# Altium project Mixed Signal Board.PrjPcb
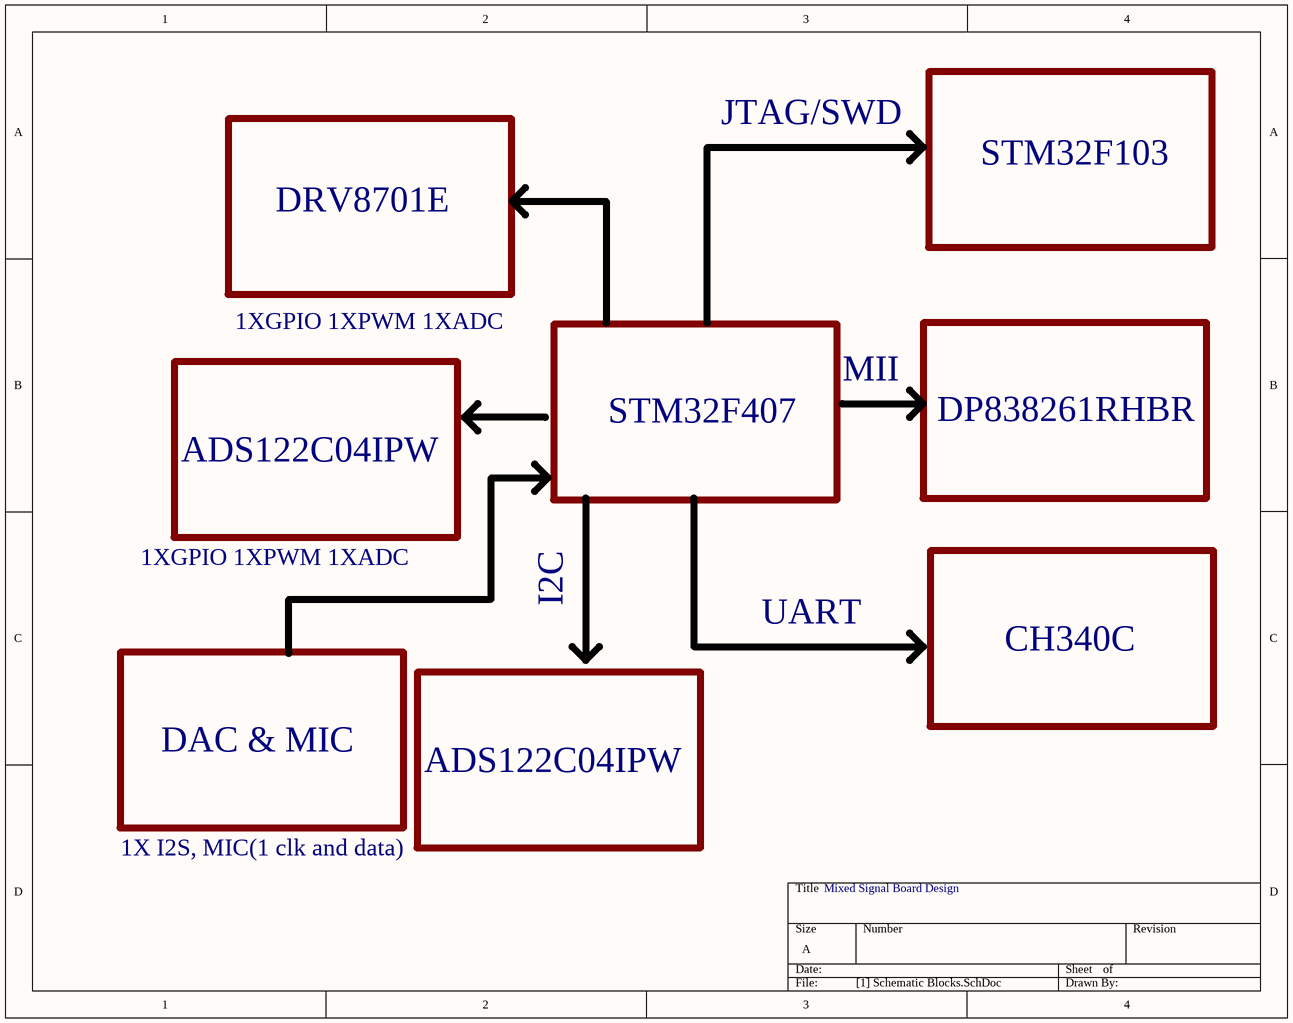
[diagram p0: [1] Schematic Blocks.SchDoc]
8 sheets, 105 parts. Net scope: flat (ports and power ports of the same name join across sheets).
Sheets:
  [1] Schematic Blocks.SchDoc
  [2] Power Budget.SchDoc
  [3] STM32F103 Debugger.SchDoc
  [4] ETHERNET PHY.SchDoc
  [5] Motor Driver Schematic.SchDoc
  [6] CH340C.SchDoc
  [7] Analog to Digital Converter.SchDoc
  [8] DAC and MIC.SchDoc

## Sheet [1] Schematic Blocks.SchDoc
size A; SheetNumber: 1; SheetTotal: 1

### Notes on the sheet
- JTAG/SWD
- DRV8701E
- STM32F103
- 1XGPIO 1XPWM 1XADC
- STM32F407
- MII
- DP838261RHBR
- ADS122C04IPW
- I2C
- UART
- CH340C
- DAC & MIC
- 1X I2S, MIC(1 clk and data)
- Mixed Signal Board Design

## Sheet [2] Power Budget.SchDoc
size A; SheetNumber: 2; SheetTotal: 4
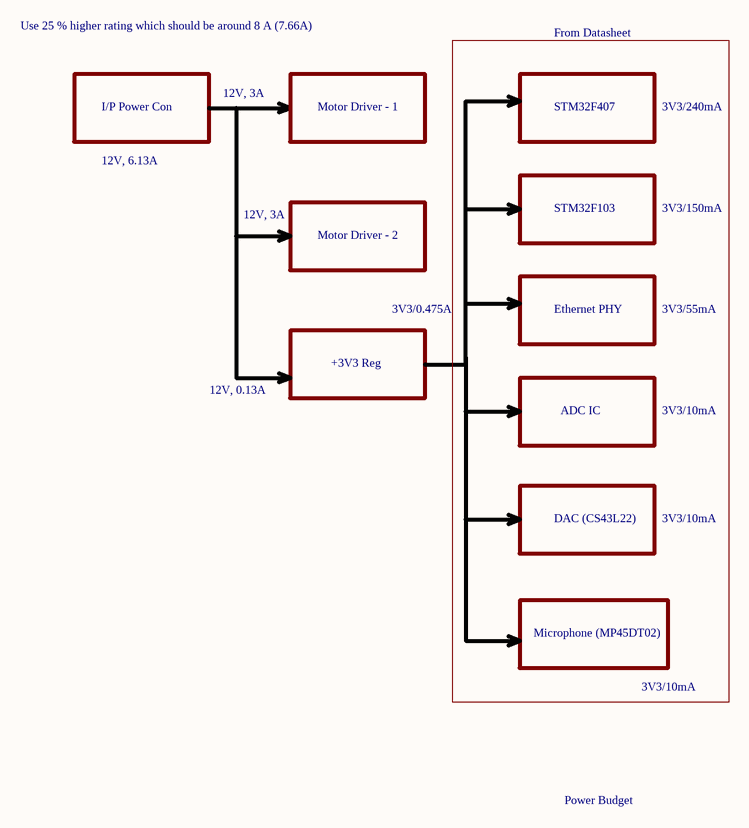
[diagram p1: [2] Power Budget.SchDoc]

### Notes on the sheet
- Use 25 % higher rating which should be around 8 A (7.66A)
- From Datasheet
- I/P Power Con
- 12V, 3A
- Motor Driver - 1
- STM32F407
- 3V3/240mA
- 12V, 6.13A
- STM32F103
- 3V3/150mA
- Motor Driver - 2
- 3V3/0.475A
- Ethernet PHY
- 3V3/55mA
- 12V, 0.13A
- +3V3 Reg
- ADC IC
- 3V3/10mA
- DAC (CS43L22)
- Microphone (MP45DT02)
- Power Budget

## Sheet [3] STM32F103 Debugger.SchDoc
size A; SheetNumber: 3; SheetTotal: 4
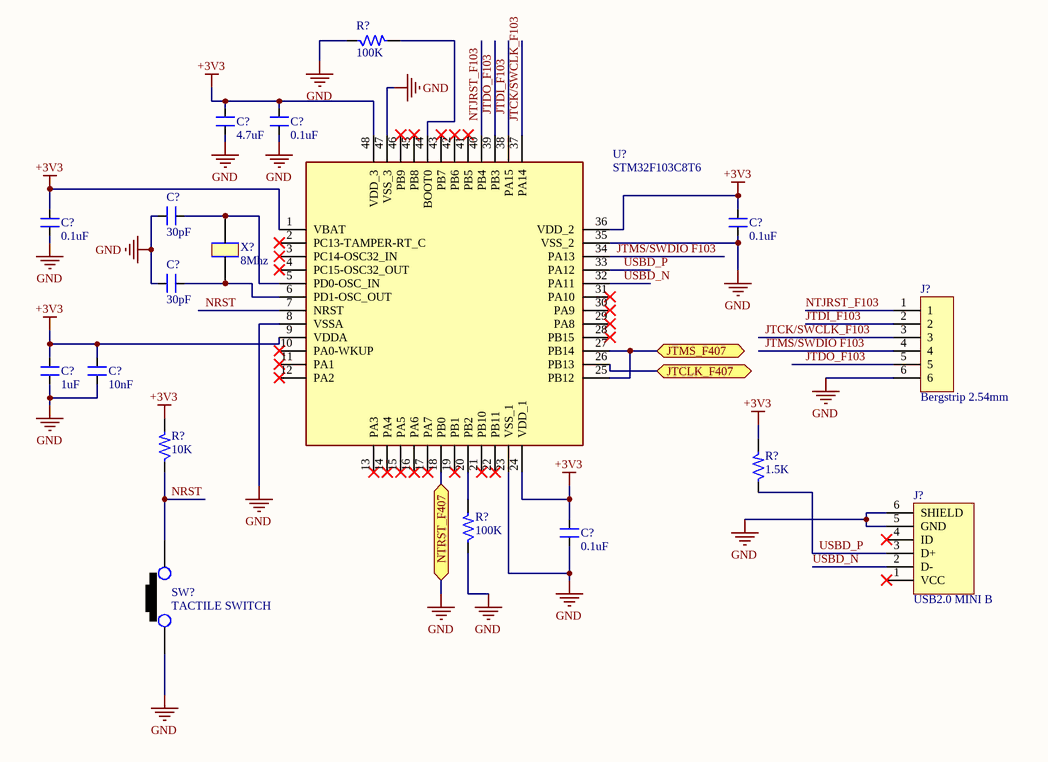
[diagram p2: [3] STM32F103 Debugger.SchDoc]

### Parts
(Parts that share a designator on the sheet are numbered #1, #2 ... from top to bottom, then left to right.)
C?#1  4.7uF  [CAP_0805]
C?#2  0.1uF  [CAP_0805]
C?#3  30pF  [CAP_0805]
C?#4  0.1uF  [CAP_0805]
C?#5  0.1uF  [CAP_0805]
C?#6  30pF  [CAP_0805]
C?#7  1uF  [CAP_0805]
C?#8  10nF  [CAP_0805]
C?#9  0.1uF  [CAP_0805]
J?#1  Bergstrip 2.54mm  [CON6_100_59D78_TH_ST]
J?#2  USB2.0 MINI B  [CON_690-005-299-043]
R?#1  100K  [RES_0603]
R?#2  10K  [RES_0805]
R?#3  1.5K  [RES_0805]
R?#4  100K  [RES_0603]
SW?#1  TACTILE SWITCH  [SW_342_SMD]
U?#1  STM32F103C8T6  [LQFP-48_19.6_393_58X11_SMD]
X?  8Mhz  [XTAL_314_240X47_SMD]

### Ports
JTCLK_F407 (bidir), JTMS_F407 (bidir), NTRST_F407 (bidir)

### Nets
+3V3: C?#1.2 C?#2.2 C?#4.2 C?#5.2 C?#7.2 C?#8.2 C?#9.2 R?#2.2 R?#3.2 U?#1.1(VBAT) U?#1.9(VDDA) U?#1.24(VDD_1) U?#1.36(VDD_2) U?#1.48(VDD_3)
GND: C?#1.1 C?#2.1 C?#3.1 C?#4.1 C?#5.1 C?#6.1 C?#7.1 C?#8.1 C?#9.1 J?#1.6 J?#2.5(GND) J?#2.6(SHIELD) R?#1.1 R?#4.1 SW?#1.1 U?#1.8(VSSA) U?#1.18(PB0) U?#1.23(VSS_1) U?#1.35(VSS_2) U?#1.47(VSS_3) ; port NTRST_F407  [project net SN]
JTCK/SWCLK_F103: J?#1.3 U?#1.37(PA14)
JTCLK_F407: U?#1.26(PB13) ; port JTCLK_F407
JTDI_F103: J?#1.2 U?#1.38(PA15)
JTDO_F103: J?#1.5 U?#1.39(PB3)
JTMS/SWDIO F103: J?#1.4 U?#1.34(PA13)
JTMS_F407: U?#1.25(PB12) U?#1.27(PB14) ; port JTMS_F407
NRST: R?#2.1 SW?#1.2 U?#1.7(NRST)
NTJRST_F103: J?#1.1 U?#1.40(PB4)
USBD_N: J?#2.2(D-) U?#1.32(PA11)
USBD_P: J?#2.3(D+) R?#3.1 U?#1.33(PA12)
NetC?#3_2: C?#3.2 U?#1.5(PD0-OSC_IN) X?.2
NetC?#6_2: C?#6.2 U?#1.6(PD1-OSC_OUT) X?.1
NetR?#1_2: R?#1.2 U?#1.44(BOOT0)
NetR?#4_2: R?#4.2 U?#1.20(PB2)

Not connected (* = marked no-connect by the designer): J?#2 1(VCC)* 4(ID)*; U?#1 2(PC13-TAMPER-RT_C)* 3(PC14-OSC32_IN)* 4(PC15-OSC32_OUT)* 10(PA0-WKUP)* 11(PA1)* 12(PA2)* 13(PA3)* 14(PA4)* 15(PA5)* 16(PA6)* 17(PA7)* 19(PB1)* 21(PB10)* 22(PB11)* 28(PB15)* 29(PA8)* 30(PA9)* 31(PA10)* 41(PB5)* 42(PB6)* 43(PB7)* 45(PB8)* 46(PB9)*

### Library data of the parts
C?#1 = CAP_4.7uF-50V-10%-0805: 4.7µF ±10% 50V Ceramic Capacitor X5R 0805 (2012 Metric); Manufacturer: Yageo; Manufacturer Part Number: GRM21BR61H475KE51L; Alternate Part Number-1: NA; Case/Package: 0805; Supplier-1: SIRICOM; Supplier Part Number-1: CL21A475KBQNNNE
C?#2 C?#4 C?#5 C?#9 = CAP_0.1uF-50V-10%-0805: 0.1µF ±10% 50V Ceramic Capacitor X7R 0805 (2012 Metric); Manufacturer: Samsung; Manufacturer Part Number: CL21B104KBCNNNC; Alternate Part Number-1: NA; Case/Package: 0805; Supplier-1: SIRICOM; Supplier Part Number-1: 0805B104K500CT
C?#3 C?#6 = CAP_30pF-50V-10%-0805: ±10% 50V Ceramic Capacitor C0G, NP0 0805 (2012 Metric); Manufacturer Part Number: C0805C300K5GAC7800; Manufacturer: KEMET; Alternate Part Number: NA; Case/Package: 0805; Supplier-1: Digikey; Supplier Part Number-1: 399-17443-1-ND - Cut Tape (CT)
C?#7 = CAP_1uF-50V-5%-0805: 1µF ±5% 50V Ceramic Capacitor X7R 0805 (2012 Metric); Manufacturer: Samsung; Manufacturer Part Number: CC0805JKX7R9BB105; Alternate Part Number-1: 0805F105M500NT; Case/Package: 0805; Supplier-1: SIRICOM; Supplier Part Number-1: CL21B105KBFNNNE
C?#8 = CAP_10nF-50V-10%-0805: 10000pF ±10% 50V Ceramic Capacitor X7R 0805 (2012 Metric); Manufacturer: Samsung; Manufacturer Part Number: C0805C103K5RECAUTO; Alternate Part Number-1: GRM2195C1H103JA01D; Case/Package: 0805; Supplier-1: SIRICOM; Supplier Part Number-1: 0805B103K500CT
J?#1 = CON-BS-SKT_6X1-100-ST-TH: 6 Pins, 1 Row 2.54mm Pitch, Straight bergstrip, Female; Manufacturer: Molex; Alternate Part Number-1: NA; Manufacturer Part Number: 22-10-2061; Case/Package: TH-CON; Supplier-1: SP ROAD; Supplier Part Number-1: NA
J?#2 = CON_USB2.0-MINIB-SMD: USB - mini B USB 2.0 Receptacle Connector 5 Position Surface Mount, Right Angle; Manufacturer: EDAC; Manufacturer Part Number: 690-005-299-043; Alternate Part Number-1: NA; Case/Package: USB-MINI-B; Supplier-1: LCSC; Supplier Part Number-1: C105424
R?#1 R?#4 = RES_100K-0.1W-1%-0603: 100 kOhms ±1% 0.1W, 1/10W Chip Resistor 0603 (1608 Metric) Automotive AEC-Q200 Thick Film; Manufacturer: Stackpole Electronics; Manufacturer Part Number: RMCF0603FT100K; Alternate Part Number-1: NA; Case/Package: 0603; Supplier-1: Arrow; Supplier Part Number-1: RMCF0603FT100K
R?#2 = RES_10K-0.125W-1%-0805: 10 kOhms ±1% 0.125W, 1/8W Chip Resistor 0805 (2012 Metric) Automotive AEC-Q200 Thick Film; Manufacturer: CTS; Manufacturer Part Number: WR08X1002FTL; Case/Package: 0805; Supplier-1: SIRICOM; Supplier Part Number-1: WR08X1002FTL; Alternate Part Number-1: WR08X1002FTL
R?#3 = RES_1.5K-0.125W-1%-0805: 1.5 kOhms ±1% 0.125W, 1/8W Chip Resistor 0805 (2012 Metric) Thick Film; Manufacturer: TE Connectivity Passive Product; Manufacturer Part Number: CRG0805F1K5; Alternate Part Number-1: NA; Case/Package: 0805; Supplier-1: SIRICOM; Supplier Part Number-1: NA
SW?#1 = SW1_RS-282G05A3-SMRT-SMD: Tactile Switch SPST-NO Top Actuated Surface Mount; Manufacturer: ITT C&K; Alternate Part Number-1: NA; Manufacturer Part Number: RS-282G05A3-SMRT; Case/Package: SMD; Supplier-1: SP ROAD; Supplier Part Number-1: RS-282G05A3-SMRT
U?#1 = IC_STM32F103C8T6: ARM® Cortex®-M3 STM32F1 Microcontroller IC 32-Bit 72MHz 64KB (64K x 8) FLASH 48-LQFP (7x7); Manufacturer: STMicroelectronics; Alternate Part Number-1: NA; Manufacturer Part Number: STM32F103C8T6; Case/Package: LQFP48; Supplier-1: LCSC; Supplier Part Number-1: STM32F103C8T6
X? = XTAL_8MHZ-ECS-80-32-5PX-SMD: 8MHz ±30ppm Crystal 32pF 60 Ohms HC-49/US; Manufacturer: Fox Electronics; Manufacturer Part Number: ECS-80-32-5PX-TR; Alternate Part Number-1: NA; Case/Package: SMD/SMT; Supplier-1: SP ROAD; Supplier Part Number-1: ECS-80-32-5PX-TR

## Sheet [4] ETHERNET PHY.SchDoc
size A; SheetNumber: 4; SheetTotal: 5
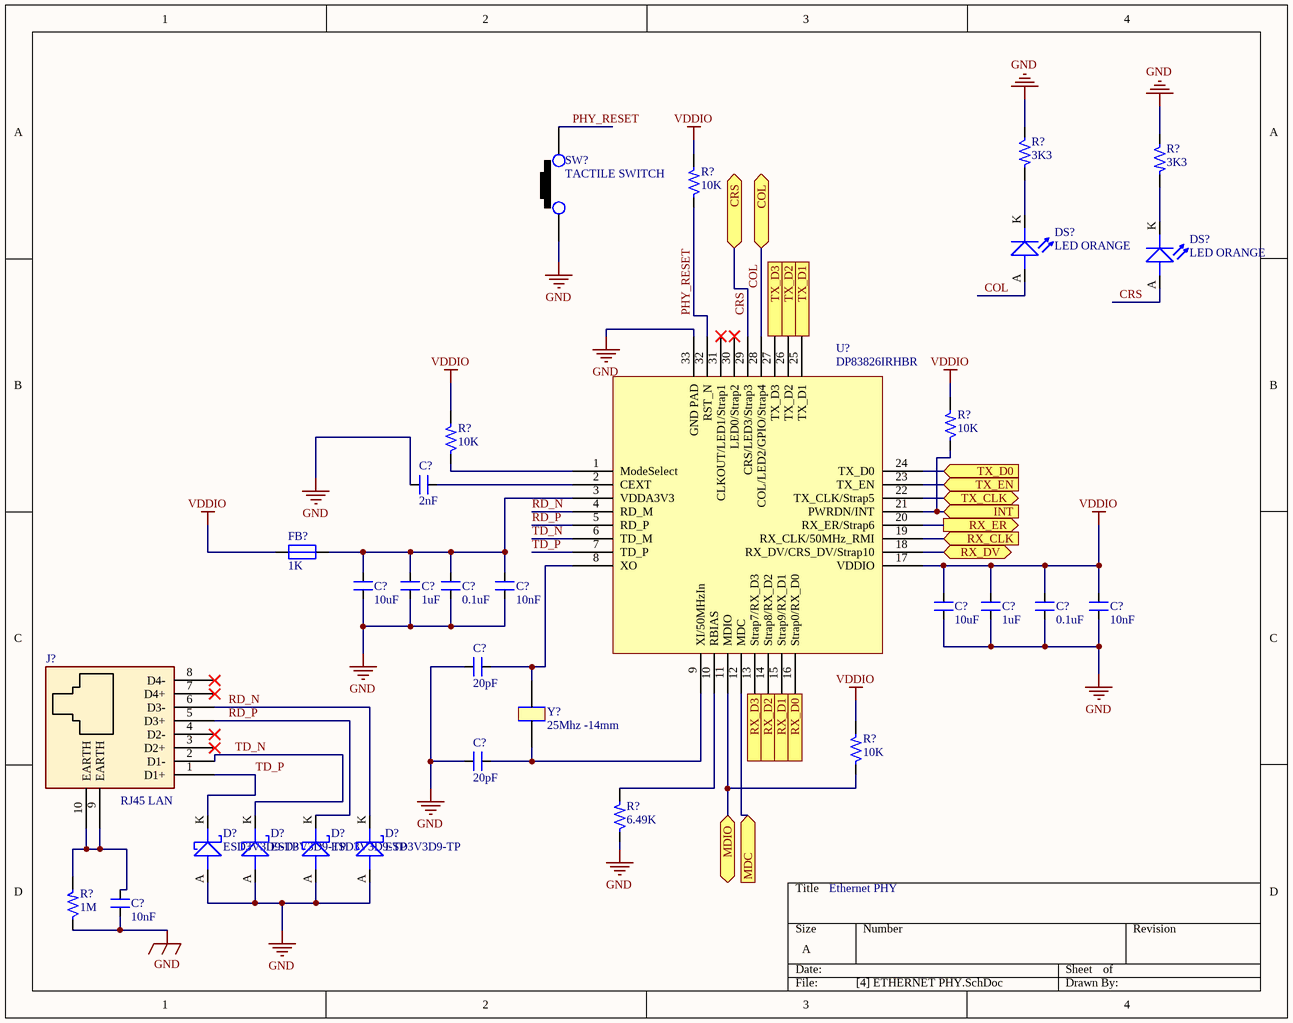
[diagram p3: [4] ETHERNET PHY.SchDoc]

### Parts
(Parts that share a designator on the sheet are numbered #1, #2 ... from top to bottom, then left to right.)
C?#10  2nF  [CAP_0805]
C?#11  10uF  [CAP_1206]
C?#12  1uF  [CAP_0805]
C?#13  0.1uF  [CAP_0805]
C?#14  10nF  [CAP_0805]
C?#15  10uF  [CAP_1206]
C?#16  1uF  [CAP_0805]
C?#17  0.1uF  [CAP_0805]
C?#18  10nF  [CAP_0805]
C?#19  20pF  [CAP_0805]
C?#20  20pF  [CAP_0805]
C?#21  10nF  [CAP_P196_102X287_H332_RAD_TH]
D?#1  ESD3V3D9-TP  [DIO_SOD-923]
D?#2  ESD3V3D9-TP  [DIO_SOD-923]
D?#3  ESD3V3D9-TP  [DIO_SOD-923]
D?#4  ESD3V3D9-TP  [DIO_SOD-923]
DS?#1  LED ORANGE  [LED_0805]
DS?#2  LED ORANGE  [LED_0805]
FB?#1  1K  [IND_0805]
J?#3  RJ45 LAN  [CON10_P106_RJ45_TH_ST]
R?#5  3K3  [RES_0603]
R?#6  3K3  [RES_0603]
R?#7  10K  [RES_0603]
R?#8  10K  [RES_0603]
R?#9  10K  [RES_0603]
R?#10  10K  [RES_0603]
R?#11  6.49K  [RES_0805]
R?#12  1M  [RES_1206]
SW?#2  TACTILE SWITCH  [SW_342_SMD]
U?#2  DP83826IRHBR  [VQFN32_19_218_23X9_SMD]
Y?  25Mhz -14mm  [XTAL_314_240X47_SMD]

### Ports
COL (bidir), CRS (bidir), INT (in), MDC (in), MDIO (bidir), RX_CLK (in), RX_D0 (out), RX_D1 (out), RX_D2 (out), RX_D3 (out), RX_DV (bidir), RX_ER (out), TX_CLK (bidir), TX_D0 (in), TX_D1 (in), TX_D2 (in), TX_D3 (in), TX_EN (in)

### Nets
GND: C?#10.1 C?#11.1 C?#12.1 C?#13.1 C?#14.1 C?#15.1 C?#16.1 C?#17.1 C?#18.1 C?#19.1 C?#20.1 C?#21.1 D?#1.A D?#2.A D?#3.A D?#4.A R?#5.1 R?#6.1 R?#11.1 R?#12.1 SW?#2.1 U?#2.33(GND_PAD)  [project net SN]
VDDIO: C?#15.2 C?#16.2 C?#17.2 C?#18.2 FB?#1.1 R?#7.2 R?#8.2 R?#9.2 R?#10.2 U?#2.17(VDDIO)
COL: DS?#1.A(ANODE) U?#2.28(COL/LED2/GPIO/Strap4) ; port COL
CRS: DS?#2.A(ANODE) U?#2.29(CRS/LED3/Strap3) ; port CRS
INT: R?#8.1 U?#2.21(PWRDN/INT) ; port INT
MDC: U?#2.12(MDC) ; port MDC
MDIO: R?#10.1 U?#2.11(MDIO) ; port MDIO
PHY_RESET: R?#7.1 SW?#2.2 U?#2.32(RST_N)
RD_N: D?#4.K J?#3.6(D3-) U?#2.4(RD_M)
RD_P: D?#3.K J?#3.5(D3+) U?#2.5(RD_P)
RX_CLK: U?#2.19(RX_CLK/50MHz_RMI) ; port RX_CLK
RX_D0: U?#2.16(Strap0/RX_D0) ; port RX_D0
RX_D1: U?#2.15(Strap9/RX_D1) ; port RX_D1
RX_D2: U?#2.14(Strap8/RX_D2) ; port RX_D2
RX_D3: U?#2.13(Strap7/RX_D3) ; port RX_D3
RX_DV: U?#2.18(RX_DV/CRS_DV/Strap10) ; port RX_DV
RX_ER: U?#2.20(RX_ER/Strap6) ; port RX_ER
TD_N: D?#2.K J?#3.2(D1-) U?#2.6(TD_M)
TD_P: D?#1.K J?#3.1(D1+) U?#2.7(TD_P)
TX_CLK: U?#2.22(TX_CLK/Strap5) ; port TX_CLK
TX_D0: U?#2.24(TX_D0) ; port TX_D0
TX_D1: U?#2.25(TX_D1) ; port TX_D1
TX_D2: U?#2.26(TX_D2) ; port TX_D2
TX_D3: U?#2.27(TX_D3) ; port TX_D3
TX_EN: U?#2.23(TX_EN) ; port TX_EN
NetC?#10_2: C?#10.2 U?#2.2(CEXT)
NetC?#11_2: C?#11.2 C?#12.2 C?#13.2 C?#14.2 FB?#1.2 U?#2.3(VDDA3V3)
NetC?#19_2: C?#19.2 U?#2.8(XO) Y?.2
NetC?#20_2: C?#20.2 U?#2.9(XI/50MHzIn) Y?.1
NetC?#21_2: C?#21.2 J?#3.9(EARTH) J?#3.10(EARTH) R?#12.2
NetDS?#1_K: DS?#1.K(CATHODE) R?#5.2
NetDS?#2_K: DS?#2.K(CATHODE) R?#6.2
NetR?#9_1: R?#9.1 U?#2.1(ModeSelect)
NetR?#11_2: R?#11.2 U?#2.10(RBIAS)

Not connected (* = marked no-connect by the designer): J?#3 3(D2+)* 4(D2-)* 7(D4+)* 8(D4-)*; U?#2 30(LED0/Strap2)* 31(CLKOUT/LED1/Strap1)*

### Notes on the sheet
- Ethernet PHY

### Library data of the parts
C?#10 = CAP_2nF-50V-10%-0805: 2000pF ±10% 50V Ceramic Capacitor X7R 0805 (2012 Metric); Manufacturer: Samsung Electro-Mechanics; Manufacturer Part Number: CL21B202KBANNNC; Alternate Part Number-1: NA; Case/Package: 0805; Supplier-1: Digikey; Supplier Part Number-1: 1276-2471-1-ND - Cut Tape (CT)
C?#11 C?#15 = CAP_10uF-50V-10%-1206: 10µF ±10% 50V Ceramic Capacitor X7R 1206 (3216 Metric); Manufacturer: KEMET; Manufacturer Part Number: CL31B106KBHNNNE; Alternate Part Number-1: GRT31CR61H106ME01L; Case/Package: 1206; Supplier-1: SIRICOM; Supplier Part Number-1: CC1206KKX5R9BB106
C?#12 C?#16 = CAP_1uF-50V-5%-0805: as C?#7 on sheet [3] STM32F103 Debugger; Case/Package: 0805; Supplier-1: SIRICOM; Supplier Part Number-1: CL21B105KBFNNNE
C?#13 C?#17 = CAP_0.1uF-50V-10%-0805: as C?#2 on sheet [3] STM32F103 Debugger; Case/Package: 0805; Supplier-1: SIRICOM; Supplier Part Number-1: 0805B104K500CT
C?#14 C?#18 = CAP_10nF-50V-10%-0805: as C?#8 on sheet [3] STM32F103 Debugger; Case/Package: 0805; Supplier-1: SIRICOM; Supplier Part Number-1: 0805B103K500CT
C?#19 C?#20 = CAP_20pF-50V-10%-0805: ±10% 50V Ceramic Capacitor C0G, NP0 0805 (2012 Metric); Manufacturer: AVX Corporation; Manufacturer Part Number: 08055A200KAT2A; Alternate Part Number-1: NA; Case/Package: 0805; Supplier-1: Digikey; Supplier Part Number-1: 478-11887-1-ND - Cut Tape (CT)
C?#21 = CAP_10nF-1KV-10%-RAD-TH: 10000pF ±10% 1000V (1kV) Ceramic Capacitor X7R Radial; Manufacturer: Yageo; Manufacturer Part Number: RDER73A103K2K1H03B; Alternate Part Number-1: NA; Case/Package: TH; Supplier-1: SP ROAD; Supplier Part Number-1: RDER73A103K2K1H03B
D?#1-D?#4 = DIO-T_3.3V-8.8V-SOD923: 8.8V Clamp 5A (8/20µs) Ipp Tvs Diode Surface Mount SOD-923; Manufacturer: Micro Commercial Co; Alternate Part Number-1: NA; Manufacturer Part Number: ESD3V3D9-TP; Case/Package: SOD923; Supplier-1: Digikey; Supplier Part Number-1: ESD3V3D9-TPMSCT-ND - Cut Tape (CT)
DS?#1 DS?#2 = LED_ORANGE-2V-20mA-0805: Orange 605nm LED Indication - Discrete 2V 0805 (2012 Metric); Manufacturer: Vishay Lite-On; Manufacturer Part Number: LTST-C170KFKT; Alternate Part Number-1: NA; Case/Package: 0805; Supplier-1: SP ROAD; Supplier Part Number-1: LTST-C170KFKT
FB?#1 = FB_1K-100MHZ-1.6A-0805: 1 kOhms @ 100MHz 1 Power Line Ferrite Bead 0805 (2012 Metric) 1.6A; Manufacturer: Laird; Manufacturer Part Number: BLM21SP102SH1D; Alternate Part Number-1: NA; Case/Package: 0805; Supplier-1: SIRICOM; Supplier Part Number-1: ACMS201209A102
J?#3 = CON-SKT-RJ_8C8P-RA-TH: 8 Pins, 2 Row 2.54mm Pitch, right angle Connector, male; Manufacturer: Assmann; Manufacturer Part Number: A-2004-2-4-LPS-N-R; Alternate Part Number-1: NA; Case/Package: TH-CON; Supplier-1: SP ROAD; Supplier Part Number-1: A-2004-2-4-LPS-N-R
R?#5 R?#6 = RES_3.3K-0.1W-1%-0603: 3.3 kOhms ±1% 0.1W, 1/10W Chip Resistor 0603 (1608 Metric) Automotive AEC-Q200 Thick Film; Manufacturer: Wilson; Manufacturer Part Number: WR06X3301FTL; Alternate Part Number-1: 0603WAF3301T5E; Case/Package: 0603; Supplier-1: SIRICOM; Supplier Part Number-1: WR06X3301FTL
R?#7-R?#10 = RES_10K-0.1W-1%-0603: 10 kOhms ±1% 0.1W, 1/10W Chip Resistor 0603 (1608 Metric) Automotive AEC-Q200 Thick Film; Manufacturer: Walsin; Manufacturer Part Number: WR06X1002FTL; Alternate Part Number-1: 0603WAJ0103T5E; Case/Package: 0603; Supplier-1: SIRICOM; Supplier Part Number-1: WR06X1002FTL
R?#11 = RES_6.49K-0.125W-1%-0805: 6.49 kOhms ±1% 0.125W, 1/8W Chip Resistor 0805 (2012 Metric) Moisture Resistant Thick Film; Manufacturer: Stackpole Electronics; Manufacturer Part Number: RC0805FR-076K49L; Alternate Part Number-1: NA; Case/Package: 0805; Supplier-1: SIRICOM; Supplier Part Number-1: WRO8X6491FTL
R?#12 = RES_1M-0.25W-1%-1206: 1 MOhms ±1% 0.25W, 1/4W Chip Resistor 1206 (3216 Metric) Automotive AEC-Q200, High Voltage Thick Film; Manufacturer: Walsin; Manufacturer Part Number: WR12X1004FTL; Alternate Part Number-1: NA; Case/Package: 1206; Supplier-1: SIRICOM; Supplier Part Number-1: WR12X1004FTL
SW?#2 = SW1_RS-282G05A3-SMRT-SMD: as SW?#1 on sheet [3] STM32F103 Debugger; Manufacturer Part Number: RS-282G05A3-SMRT; Case/Package: SMD; Supplier-1: SP ROAD; Supplier Part Number-1: RS-282G05A3-SMRT
U?#2 = IC_DP83826IRHBR: Ethernet ICs Low latency 10/100-Mbps PHY, MII interface and enhanced mode with an industrial temperature range 32-VQFN -40 to 85; Manufacturer: Texas Instruments; Alternate Part Number-1: NA; Manufacturer Part Number: DP83826IRHBR; Case/Package: 32-VQFN; Supplier-1: Mouser; Supplier Part Number-1: 595-DP83826IRHBR
Y? = XTAL_25Mhz-FOXSDLF/250F-20: 25MHz ±30ppm Crystal 20pF 30 Ohms HC-49/US; Manufacturer: Abracon; Alternate Part Number-1: NA; Manufacturer Part Number: FOXSDLF/250F-20; Case/Package: SMD; Supplier-1: MOUSER; Supplier Part Number-1: FOXSDLF/250F-20

## Sheet [5] Motor Driver Schematic.SchDoc
size A; SheetNumber: 5; SheetTotal: 5
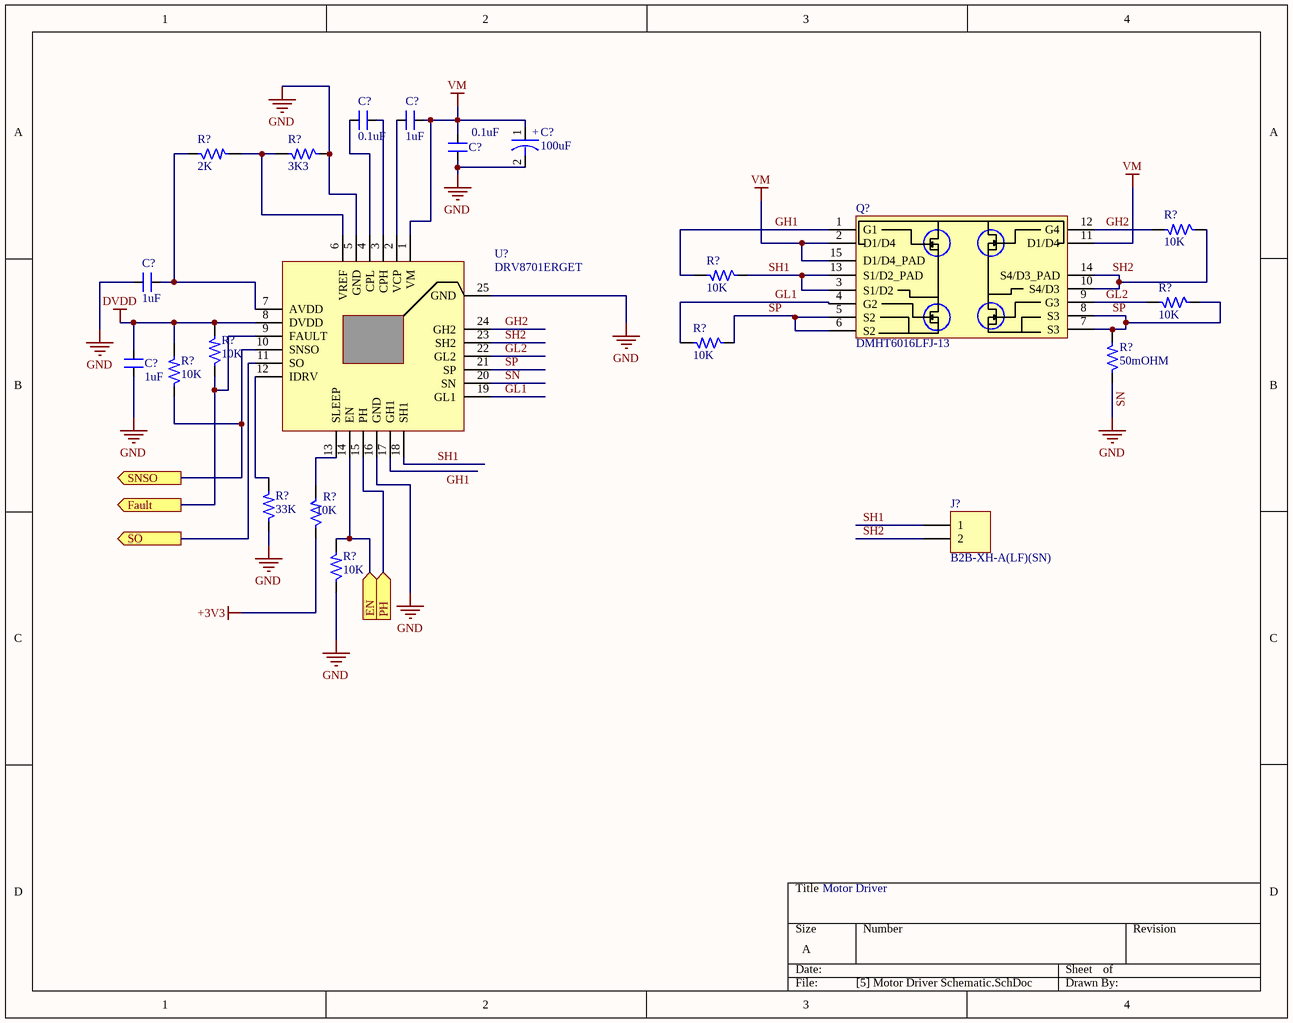
[diagram p4: [5] Motor Driver Schematic.SchDoc]

### Parts
(Parts that share a designator on the sheet are numbered #1, #2 ... from top to bottom, then left to right.)
C?#22  0.1uF  [CAP_0805]
C?#23  1uF  [CAP_0805]
C?#24  100uF  [ACAP_P236_D305_H303_RAD]
C?#25  0.1uF  [CAP_0805]
C?#26  1uF  [CAP_0805]
C?#27  1uF  [CAP_0805]
J?#4  B2B-XH-A(LF)(SN)  [CON2_100_B2B-XH-A_TH_ST]
Q?  DMHT6016LFJ-13  [DFN5045-12_33_212_27X15_SMD_1]
R?#13  2K  [RES_0603]
R?#14  3K3  [RES_0603]
R?#15  10K  [RES_0603]
R?#16  10K  [RES_0603]
R?#17  10K  [RES_0603]
R?#18  10K  [RES_0603]
R?#19  10K  [RES_0603]
R?#20  50mOHM  [RES_2512]
R?#21  10K  [RES_0603]
R?#22  33K  [RES_0805]
R?#23  10K  [RES_0603]
R?#24  10K  [RES_0603]
U?#3  DRV8701ERGET  [VFQFN24_19.6_196_12X32_SMD_1]

### Ports
EN (in), Fault (out), PH (in), SNSO (out), SO (out)

### Nets
+3V3: R?#23.1
DVDD: C?#27.2 R?#19.2 R?#21.2 U?#3.8(DVDD)
SN: C?#24.2 C?#25.1 C?#26.1 C?#27.1 R?#14.1 R?#20.1 R?#22.1 R?#24.1 U?#3.5(GND) U?#3.16(GND) U?#3.20(SN) U?#3.25(GND)  [also labelled GND]
VM: C?#23.2 C?#24.1 C?#25.2 Q?.2(D1/D4) Q?.11(D1/D4) Q?.15(D1/D4_PAD) U?#3.1(VM)
EN: R?#24.2 U?#3.14(EN) ; port EN
Fault: R?#19.1 U?#3.9(FAULT) ; port Fault
GH1: Q?.1(G1) R?#16.2 U?#3.17(GH1)
GH2: Q?.12(G4) R?#15.2 U?#3.24(GH2)
GL1: Q?.4(G2) R?#18.2 U?#3.19(GL1)
GL2: Q?.9(G3) R?#17.2 U?#3.22(GL2)
PH: U?#3.15(PH) ; port PH
SH1: J?#4.1 Q?.3(S1/D2) Q?.13(S1/D2_PAD) R?#16.1 U?#3.18(SH1)
SH2: J?#4.2 Q?.10(S4/D3) Q?.14(S4/D3_PAD) R?#15.1 U?#3.23(SH2)
SNSO: R?#21.1 U?#3.10(SNSO) ; port SNSO
SO: U?#3.11(SO) ; port SO
SP: Q?.5(S2) Q?.6(S2) Q?.7(S3) Q?.8(S3) R?#17.1 R?#18.1 R?#20.2 U?#3.21(SP)
NetC?#22_1: C?#22.1 U?#3.4(CPL)
NetC?#22_2: C?#22.2 U?#3.3(CPH)
NetC?#23_1: C?#23.1 U?#3.2(VCP)
NetC?#26_2: C?#26.2 R?#13.1 U?#3.7(AVDD)
NetR?#13_2: R?#13.2 R?#14.2 U?#3.6(VREF)
NetR?#22_2: R?#22.2 U?#3.12(IDRV)
NetR?#23_2: R?#23.2 U?#3.13(SLEEP)

### Notes on the sheet
- Motor Driver
- (in symbol CAP-P_100uF-25V-20%-RAD) +

### Library data of the parts
C?#22 C?#25 = CAP_0.1uF-50V-10%-0805: as C?#2 on sheet [3] STM32F103 Debugger; Case/Package: 0805; Supplier-1: SIRICOM; Supplier Part Number-1: 0805B104K500CT
C?#23 C?#26 C?#27 = CAP_1uF-50V-5%-0805: as C?#7 on sheet [3] STM32F103 Debugger; Case/Package: 0805; Supplier-1: SIRICOM; Supplier Part Number-1: CL21B105KBFNNNE
C?#24 = CAP-P_100uF-25V-20%-RAD: 100µF 25V Aluminum Electrolytic Capacitors Radial, Can - SMD 1000 Hrs @ 105°C; Manufacturer: Nichicon; Manufacturer Part Number: UWT1E101MCL1GS; Alternate Part Number-1: NA; Case/Package: Radial-SMD; Supplier-1: SP ROAD; Supplier Part Number-1: UWT1E101MCL1GS
J?#4 = CON-PLG_2X1-100-ST-TH: 2 Pins, 1 Row 2.54mm Pitch, Straight Connector, male; Manufacturer: JST; Mating Part Number: XHP-2; Crimp Part Number: ASXHSXH22K51; Alternate Part Number-1: NA; Manufacturer Part Number: B2B-XH-A(LF)(SN); Case/Package: TH-CON; Supplier-1: SP ROAD; Supplier Part Number-1: B2B-XH-A(LF)(SN)
Q? = MOSFET-N_60V-14.8A-V-DFN5045-12: Mosfet Array 4 N-Channel 14.8A (Ta) Surface Mount V-DFN5045-12; Manufacturer: ON Semiconductor; Alternate Part Number-1: DMHT3006LFJ-13; Manufacturer Part Number: DMHT6016LFJ-13; Case/Package: DFN5045-12; Supplier-1: LCSC; Supplier Part Number-1: C460986
R?#13 = RES_2K-0.125W-1%-0603: 2 kOhms ±1% 0.125W, 1/8W Chip Resistor 0603 (1608 Metric) Anti-Sulfur, Moisture Resistant Thin Film; Manufacturer: Stackpole Electronics; Manufacturer Part Number: RNCP0603FTD2K00; Alternate Part Number-1: NA; Case/Package: 0603; Supplier-1: SIRICOM; Supplier Part Number-1: WR06X2001FTL
R?#14 = RES_3.3K-0.1W-1%-0603: as R?#5 on sheet [4] ETHERNET PHY; Case/Package: 0603; Supplier-1: SIRICOM; Supplier Part Number-1: WR06X3301FTL
R?#15-R?#19 R?#21 R?#23 R?#24 = RES_10K-0.1W-1%-0603: as R?#7 on sheet [4] ETHERNET PHY; Case/Package: 0603; Supplier-1: SIRICOM; Supplier Part Number-1: WR06X1002FTL
R?#20 = RES_50mOhm-2W-1%-2512: 50 mOhms ±1% 2W Chip Resistor 2512 (6432 Metric) Automotive AEC-Q200, Current Sense, Moisture Resistant Metal Element; Manufacturer: Yageo; Manufacturer Part Number: PA2512FKF7W0R05E; Alternate Part Number-1: PMR100HZPFU5L00; Case/Package: 2512; Supplier-1: SIRICOM; Supplier Part Number-1: LR2512-22R060F1
R?#22 = RES_33K-0.125W-1%-0805: Thick Film Resistors - SMD 33KOhms 1/8W 150V33 kOhms ±1% 0.125W, 1/8W Chip Resistor 0805 (2012 Metric) Thick Film; Manufacturer: Vishay BCcomponents; Manufacturer Part Number: CRG0805F33K; Alternate Part Number-1: NA; Case/Package: 0805; Supplier-1: SIRICOM; Supplier Part Number-1: WR08X3302FTL
U?#3 = IC_DRV8701ERGET: Motor Driver Power MOSFET Parallel 24-VQFN (4x4); Manufacturer: Texas Instruments; Alternate Part Number-1: NA; Manufacturer Part Number: DRV8701ERGET; Case/Package: VFQFN24; Supplier-1: ARROW; Supplier Part Number-1: DRV8701ERGET

## Sheet [6] CH340C.SchDoc
size A; SheetNumber: 6; SheetTotal: 6
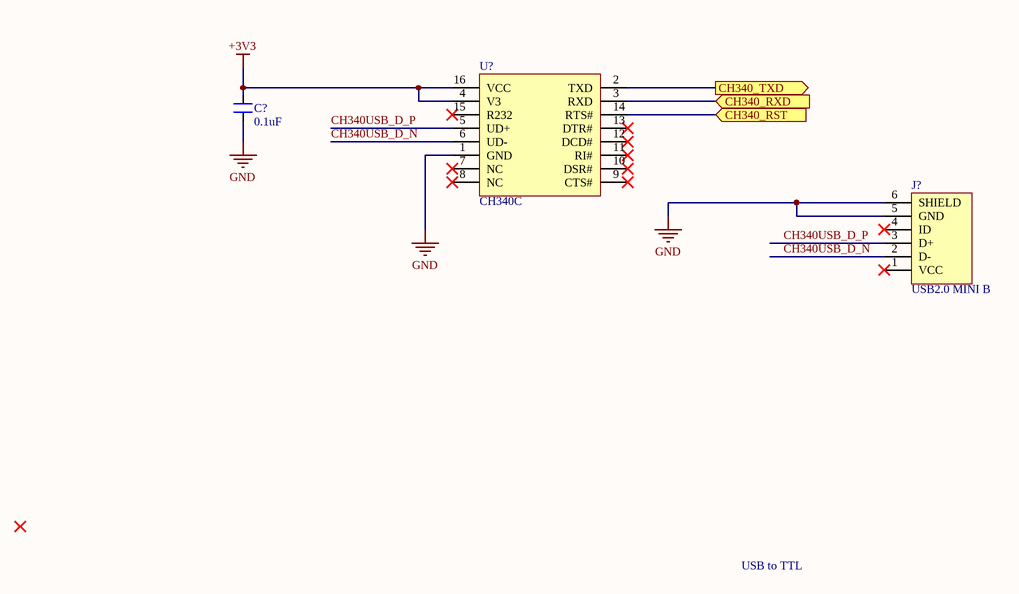
[diagram p5: [6] CH340C.SchDoc]

### Parts
(Parts that share a designator on the sheet are numbered #1, #2 ... from top to bottom, then left to right.)
C?#28  0.1uF  [CAP_0805]
J?#5  USB2.0 MINI B  [CON_690-005-299-043]
U?#4  CH340C  [SOIC16_50_284_25X90_SMT]

### Ports
CH340_RST (in), CH340_RXD (in), CH340_TXD (out)

### Nets
+3V3: C?#28.2 U?#4.4(V3) U?#4.16(VCC)
GND: C?#28.1 J?#5.5(GND) J?#5.6(SHIELD) U?#4.1(GND)  [project net SN]
CH340_RST: U?#4.14(RTS#) ; port CH340_RST
CH340_RXD: U?#4.3(RXD) ; port CH340_RXD
CH340_TXD: U?#4.2(TXD) ; port CH340_TXD
CH340USB_D_N: J?#5.2(D-) U?#4.6(UD-)
CH340USB_D_P: J?#5.3(D+) U?#4.5(UD+)

Not connected (* = marked no-connect by the designer): J?#5 1(VCC)* 4(ID)*; U?#4 7(NC)* 8(NC)* 9(CTS#)* 10(DSR#)* 11(RI#)* 12(DCD#)* 13(DTR#)* 15(R232)*

### Notes on the sheet
- USB to TTL

### Library data of the parts
C?#28 = CAP_0.1uF-50V-5%-0805: 0.1µF ±5% 50V Ceramic Capacitor X7R 0805 (2012 Metric); Manufacturer: AVX Corporation; Manufacturer Part Number: 08055C104JAT4A; Alternate Part Number-1: 0805B104M500; Case/Package: 0805; Supplier-1: SIRICOM; Supplier Part Number-1: 0805B104J500CT
J?#5 = CON_USB2.0-MINIB-SMD: as J?#2 on sheet [3] STM32F103 Debugger; Case/Package: USB-MINI-B; Supplier-1: LCSC; Supplier Part Number-1: C105424
U?#4 = IC_CH340C: USB Bridge, USB to UART USB 2.0 UART Interface; Manufacturer: Olimex; Alternate Part Number-1: NA; Manufacturer Part Number: CH340C; Case/Package: SOIC16; Supplier-1: LCSC; Supplier Part Number-1: C84681

## Sheet [7] Analog to Digital Converter.SchDoc
size A; SheetNumber: 7; SheetTotal: 7
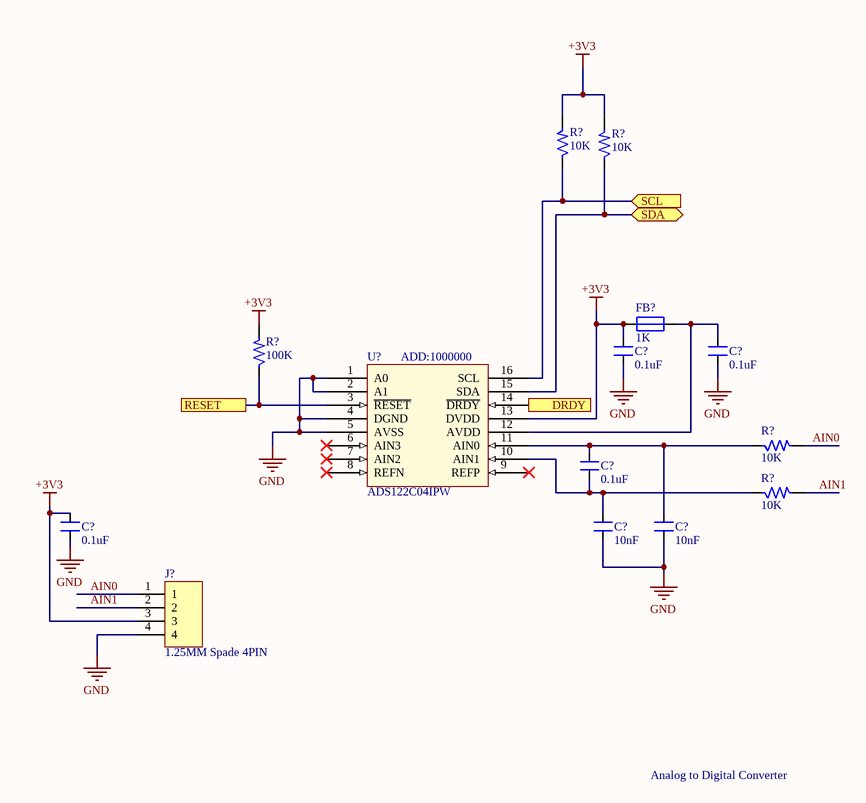
[diagram p6: [7] Analog to Digital Converter.SchDoc]

### Parts
(Parts that share a designator on the sheet are numbered #1, #2 ... from top to bottom, then left to right.)
C?#29  0.1uF  [CAP_0805]
C?#30  0.1uF  [CAP_0805]
C?#31  0.1uF  [CAP_0805]
C?#32  0.1uF  [CAP_0805]
C?#33  10nF  [CAP_0805]
C?#34  10nF  [CAP_0805]
FB?#2  1K  [IND_0805]
J?#6  1.25MM Spade 4PIN  [CON4_50_653004117322_TH_RA]
R?#25  10K  [RES_0603]
R?#26  10K  [RES_0603]
R?#27  100K  [RES_0603]
R?#28  10K  [RES_0603]
R?#29  10K  [RES_0603]
U?#5  ADS122C04IPW  [TSSOP16_25-59_294_54X14_SMT]

### Ports
DRDY, RESET, SCL (in), SDA (bidir)

### Nets
+3V3: C?#29.2 C?#32.2 FB?#2.1 J?#6.3 R?#25.2 R?#26.2 R?#27.2 U?#5.13(DVDD)
GND: C?#29.1 C?#30.1 C?#32.1 C?#33.1 C?#34.1 J?#6.4 U?#5.1(A0) U?#5.2(A1) U?#5.4(DGND) U?#5.5(AVSS)  [project net SN]
AIN0: J?#6.1 R?#28.2
AIN1: J?#6.2 R?#29.2
DRDY: U?#5.14(~{DRDY}) ; port DRDY
RESET: R?#27.1 U?#5.3(~{RESET}) ; port RESET
SCL: R?#25.1 U?#5.16(SCL) ; port SCL
SDA: R?#26.1 U?#5.15(SDA) ; port SDA
NetC?#30_2: C?#30.2 FB?#2.2 U?#5.12(AVDD)
NetC?#31_1: C?#31.1 C?#33.2 R?#29.1 U?#5.10(AIN1)
NetC?#31_2: C?#31.2 C?#34.2 R?#28.1 U?#5.11(AIN0)

Not connected (* = marked no-connect by the designer): U?#5 6(AIN3)* 7(AIN2)* 8(REFN)* 9(REFP)*

### Notes on the sheet
- (near U?#5) ADD:1000000
- Analog to Digital Converter

### Library data of the parts
C?#29 C?#30 C?#32 = CAP_0.1uF-50V-5%-0805: as C?#28 on sheet [6] CH340C; Case/Package: 0805; Supplier-1: SIRICOM; Supplier Part Number-1: 0805B104J500CT
C?#31 = CAP_0.1uF-50V-10%-0805: as C?#2 on sheet [3] STM32F103 Debugger; Case/Package: 0805; Supplier-1: SIRICOM; Supplier Part Number-1: 0805B104K500CT
C?#33 C?#34 = CAP_10nF-50V-10%-0805: as C?#8 on sheet [3] STM32F103 Debugger; Case/Package: 0805; Supplier-1: SIRICOM; Supplier Part Number-1: 0805B103K500CT
FB?#2 = FB_1K-100MHZ-1.6A-0805: as FB?#1 on sheet [4] ETHERNET PHY; Case/Package: 0805; Supplier-1: SIRICOM; Supplier Part Number-1: ACMS201209A102
J?#6 = CON-PLG_4X1-50-RA-TH: 4 Pins, 1 Row 1.25mm Pitch, right angle Connector, male; Manufacturer Part Number: 653004117322; Manufacturer: JST; Mating Part Number: 653004113322; Crimp Part Number: 653153128130; Alternate Part Number-1: NA; Case/Package: TH-CON; Supplier-1: WURTH; Supplier Part Number-1: 653004117322
R?#25 R?#26 R?#28 R?#29 = RES_10K-0.1W-1%-0603: as R?#7 on sheet [4] ETHERNET PHY; Case/Package: 0603; Supplier-1: SIRICOM; Supplier Part Number-1: WR06X1002FTL
R?#27 = RES_100K-0.1W-1%-0603: as R?#1 on sheet [3] STM32F103 Debugger; Case/Package: 0603; Supplier-1: Arrow; Supplier Part Number-1: RMCF0603FT100K
U?#5 = IC_ADS122C04IPW: 24 Bit Analog to Digital Converter 4 Input 1 Sigma-Delta 16-TSSOP; Manufacturer: Texas Instruments; Alternate Part Number-1: NA; Manufacturer Part Number: ADS122C04IPW; Case/Package: TSSOP16; Supplier-1: MOUSER; Supplier Part Number-1: ADS122C04IPW

## Sheet [8] DAC and MIC.SchDoc
size A; SheetNumber: 8; SheetTotal: 8
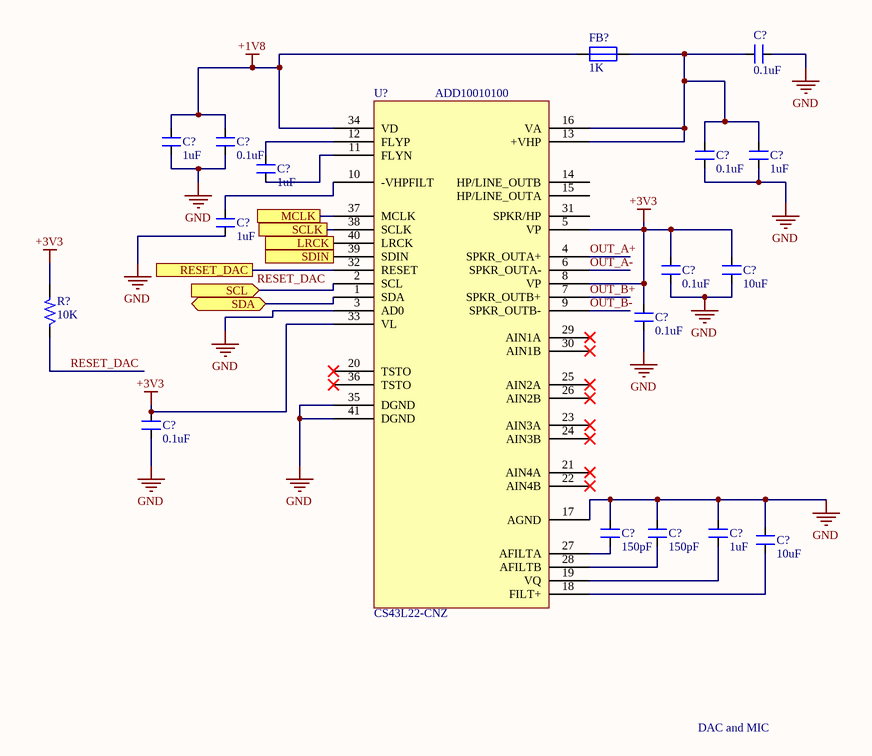
[diagram p7: [8] DAC and MIC.SchDoc]

### Parts
(Parts that share a designator on the sheet are numbered #1, #2 ... from top to bottom, then left to right.)
C?#35  0.1uF  [CAP_0805]
C?#36  1uF  [CAP_0805]
C?#37  0.1uF  [CAP_0805]
C?#38  0.1uF  [CAP_0805]
C?#39  1uF  [CAP_0805]
C?#40  1uF  [CAP_0805]
C?#41  1uF  [CAP_0805]
C?#42  0.1uF  [CAP_0805]
C?#43  10uF  [CAP_1206]
C?#44  0.1uF  [CAP_0805]
C?#45  0.1uF  [CAP_0805]
C?#46  150pF  [CAP_0805]
C?#47  150pF  [CAP_0805]
C?#48  1uF  [CAP_0805]
C?#49  10uF  [CAP_1206]
FB?#3  1K  [IND_0805]
R?#30  10K  [RES_0603]
U?#6  CS43L22-CNZ  [QFN40_19_284_33X9_SMD]

### Ports
LRCK, MCLK, RESET_DAC, SCL (in, see [7] Analog to Digital Converter[3B]), SCLK, SDA (bidir, see [7] Analog to Digital Converter[3B]), SDIN

### Nets
+1V8: C?#36.2 C?#37.2 FB?#3.2 U?#6.34(VD)
+3V3: C?#42.2 C?#43.2 C?#44.2 C?#45.2 R?#30.2 U?#6.5(VP) U?#6.8(VP) U?#6.33(VL)
GND: C?#35.1 C?#36.1 C?#37.1 C?#38.1 C?#39.1 C?#41.1 C?#42.1 C?#43.1 C?#44.1 C?#45.1 C?#46.2 C?#47.2 C?#48.2 C?#49.2 U?#6.3(AD0) U?#6.17(AGND) U?#6.35(DGND) U?#6.41(DGND)  [project net SN]
LRCK: U?#6.40(LRCK) ; port LRCK
MCLK: U?#6.37(MCLK) ; port MCLK
OUT_A+: U?#6.4(SPKR_OUTA+)
OUT_A-: U?#6.6(SPKR_OUTA-)
OUT_B+: U?#6.7(SPKR_OUTB+)
OUT_B-: U?#6.9(SPKR_OUTB-)
RESET_DAC: R?#30.1 U?#6.32(RESET) ; port RESET_DAC
SCL: U?#6.2(SCL) ; port SCL
SCLK: U?#6.38(SCLK) ; port SCLK
SDA: U?#6.1(SDA) ; port SDA
SDIN: U?#6.39(SDIN) ; port SDIN
NetC?#35_2: C?#35.2 C?#38.2 C?#39.2 FB?#3.1 U?#6.13(+VHP) U?#6.16(VA)
NetC?#40_1: C?#40.1 U?#6.11(FLYN)
NetC?#40_2: C?#40.2 U?#6.12(FLYP)
NetC?#41_2: C?#41.2 U?#6.10(-VHPFILT)
NetC?#46_1: C?#46.1 U?#6.27(AFILTA)
NetC?#47_1: C?#47.1 U?#6.28(AFILTB)
NetC?#48_1: C?#48.1 U?#6.19(VQ)
NetC?#49_1: C?#49.1 U?#6.18(FILT+)

Not connected (* = marked no-connect by the designer): U?#6 14(HP/LINE_OUTB) 15(HP/LINE_OUTA) 20(TSTO)* 21(AIN4A)* 22(AIN4B)* 23(AIN3A)* 24(AIN3B)* 25(AIN2A)* 26(AIN2B)* 29(AIN1A)* 30(AIN1B)* 31(SPKR/HP) 36(TSTO)*

### Notes on the sheet
- (near U?#6) ADD10010100
- DAC and MIC

### Library data of the parts
C?#35 C?#37 C?#38 C?#42 C?#44 C?#45 = CAP_0.1uF-50V-10%-0805: as C?#2 on sheet [3] STM32F103 Debugger; Case/Package: 0805; Supplier-1: SIRICOM; Supplier Part Number-1: 0805B104K500CT
C?#36 C?#39-C?#41 C?#48 = CAP_1uF-50V-5%-0805: as C?#7 on sheet [3] STM32F103 Debugger; Case/Package: 0805; Supplier-1: SIRICOM; Supplier Part Number-1: CL21B105KBFNNNE
C?#43 C?#49 = CAP_10uF-50V-10%-1206: as C?#11 on sheet [4] ETHERNET PHY; Case/Package: 1206; Supplier-1: SIRICOM; Supplier Part Number-1: CC1206KKX5R9BB106
C?#46 C?#47 = CAP_150pF-50V-10%-0805: 150pF ±10% 50V Ceramic Capacitor C0G, NP0 0805 (2012 Metric); Manufacturer: AVX Corporation; Manufacturer Part Number: 08055A151KAT2A; Alternate Part Number-1: NA; Case/Package: 0805; Supplier-1: Digikey; Supplier Part Number-1: 478-10501-1-ND - Cut Tape (CT)
FB?#3 = FB_1K-100MHZ-1.6A-0805: as FB?#1 on sheet [4] ETHERNET PHY; Case/Package: 0805; Supplier-1: SIRICOM; Supplier Part Number-1: ACMS201209A102
R?#30 = RES_10K-0.1W-1%-0603: as R?#7 on sheet [4] ETHERNET PHY; Case/Package: 0603; Supplier-1: SIRICOM; Supplier Part Number-1: WR06X1002FTL
U?#6 = IC_CS43L22: Audio D/A Converter ICs Low Power Stereo DAC w/ClassD Spkr Driver; Manufacturer: Cirrus Logic; Alternate Part Number-1: NA; Manufacturer Part Number: CS43L22-CNZ; Case/Package: QFN-40; Supplier-1: Mouser; Supplier Part Number-1: 777-CS43L22-CNZ

## Nets that join several sheets
+3V3: [3] STM32F103 Debugger (14 pins), [5] Motor Driver Schematic (R?#23.1), [6] CH340C (C?#28.2 U?#4.4 U?#4.16), [7] Analog to Digital Converter (8 pins), [8] DAC and MIC (8 pins)
SN: [3] STM32F103 Debugger (20 pins), [4] ETHERNET PHY (22 pins), [5] Motor Driver Schematic (12 pins), [6] CH340C (C?#28.1 J?#5.5 J?#5.6 U?#4.1), [7] Analog to Digital Converter (10 pins), [8] DAC and MIC (18 pins)
SCL: [7] Analog to Digital Converter (R?#25.1 U?#5.16), [8] DAC and MIC (U?#6.2)
SDA: [7] Analog to Digital Converter (R?#26.1 U?#5.15), [8] DAC and MIC (U?#6.1)